# EAGLE design lopen (EAGLE 5.11)
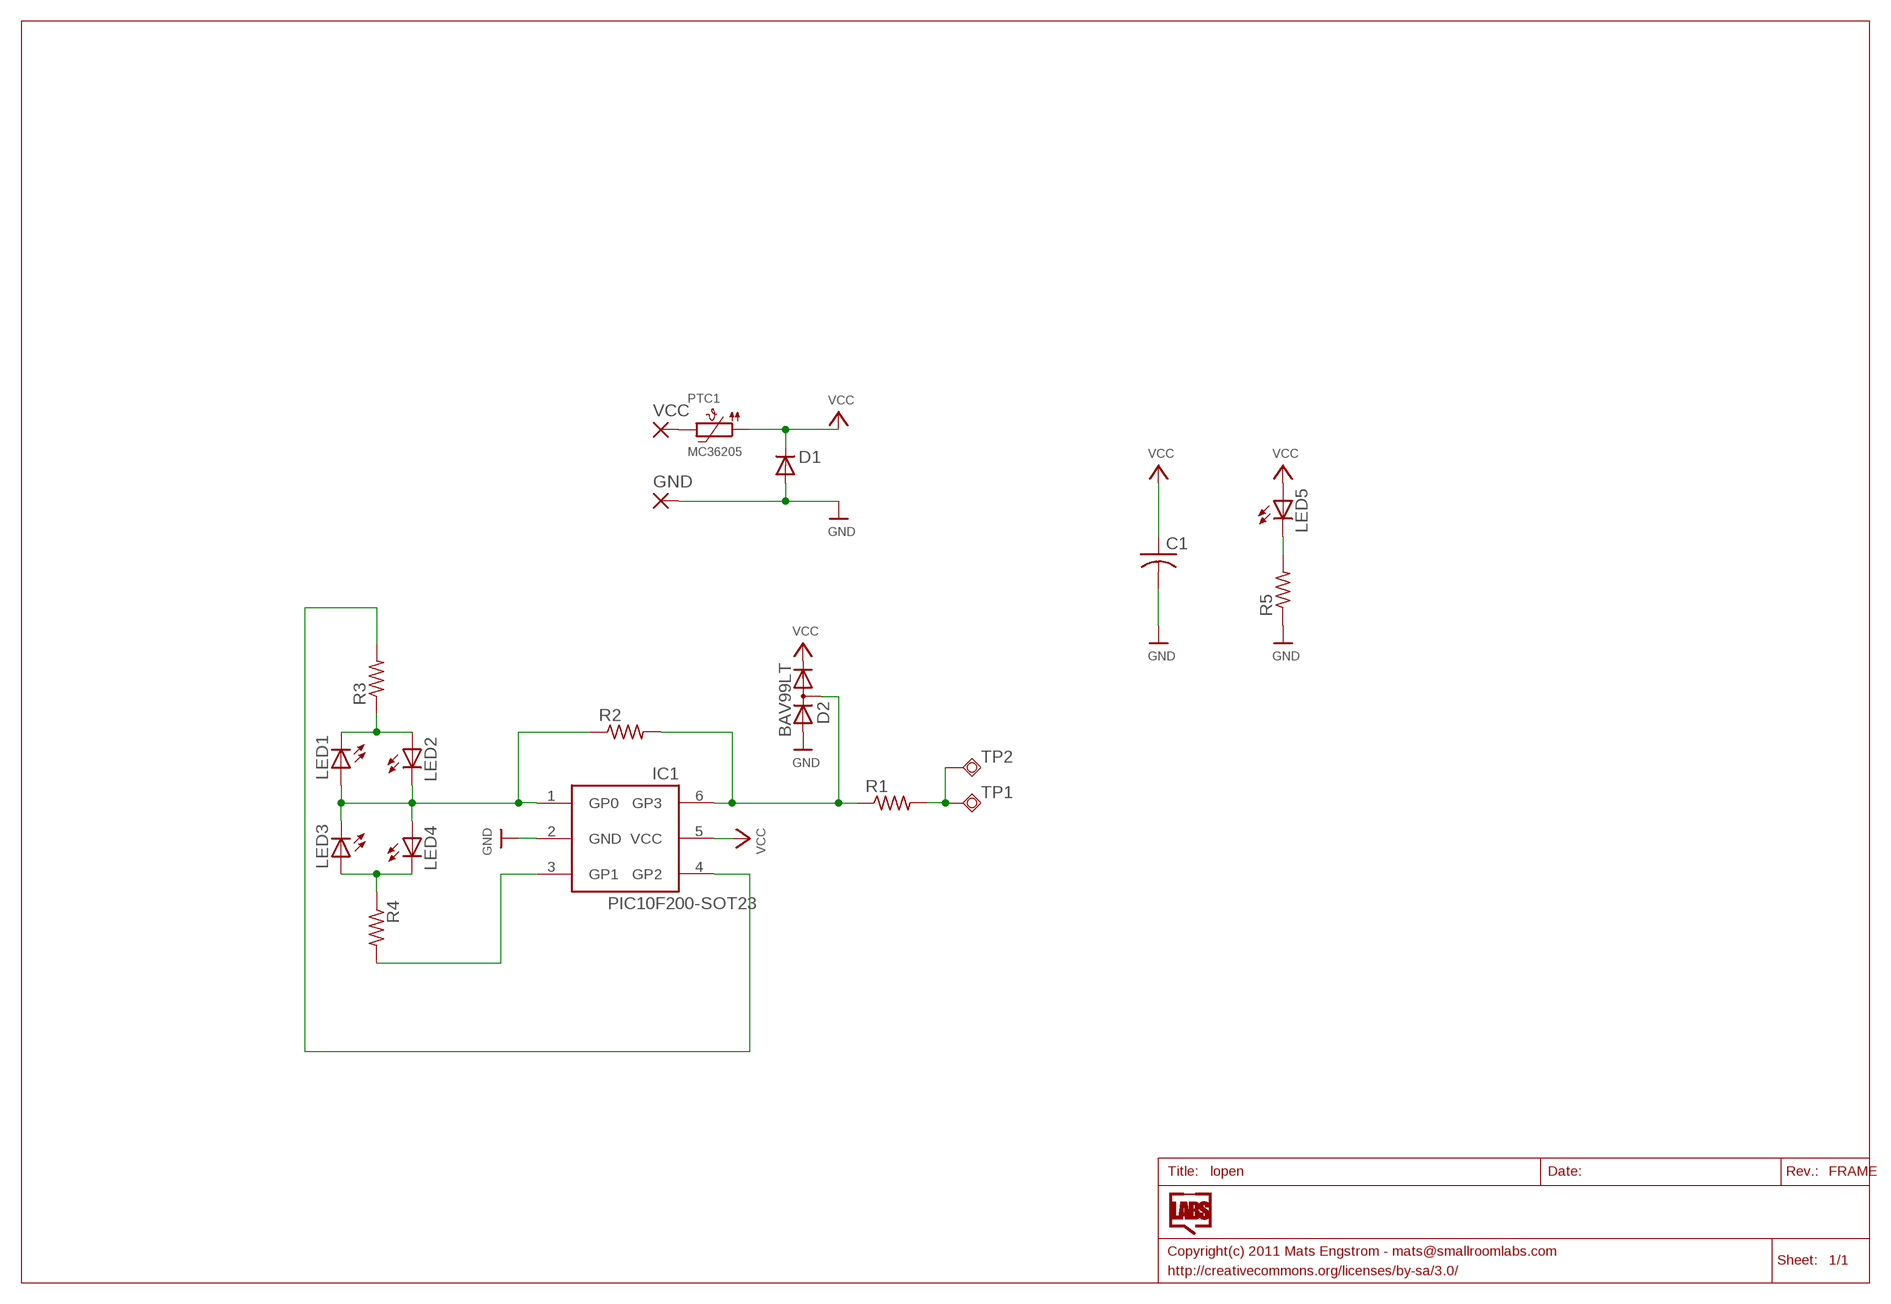
[diagram p0: schematic, sheet 1]

## Parts
C1  C-USC0805  [C0805]
D1  DIODESMA  [SMA-DIODE]
D2  BAV99LT  DIODE_2CACA-SOT23  [SOT23]
GND  1,6/0,8  [1,6/0,8]
IC1  PIC10F200-SOT23  [SOT23-6]
LED1  LEDCHIP-LED0805  [CHIP-LED0805]
LED2  LEDCHIP-LED0805  [CHIP-LED0805]
LED3  LEDCHIP-LED0805  [CHIP-LED0805]
LED4  LEDCHIP-LED0805  [CHIP-LED0805]
LED5  LEDCHIP-LED0805  [CHIP-LED0805]
PTC1  MC36205  PTC1206  [1206]
R1  R-US_R0805  [R0805]
R2  R-US_R0805  [R0805]
R3  R-US_R0805  [R0805]
R4  R-US_R0805  [R0805]
R5  R-US_R0805  [R0805]
TP1  TPSQTP18SQ  [TP18SQ]
TP2  TPSQTP18SQ  [TP18SQ]
VCC  1,6/0,8  [1,6/0,8]

## Nets
GND: C1.2 D1.A D2.1(A) GND.1(P) IC1.2(GND) R5.1
LED_CENTER: IC1.1(GP0) LED1.A LED2.C LED3.C LED4.A R2.1
LED_ONE: IC1.4(GP2) R3.2
LED_TWO: IC1.3(GP1) R4.2
N$1: LED5.C R5.2
N$2: PTC1.2 VCC.1(P)
N$5: LED1.C LED2.A R3.1
N$6: LED3.A LED4.C R4.1
N$9: R1.2 TP1.TP TP2.TP
SENSE: D2.3(AC) IC1.6(GP3) R1.1 R2.2
VCC: C1.1 D1.C D2.2(C) IC1.5(VCC) LED5.A PTC1.1

## Library data of the parts
C1 = adafruit:C-US: CAPACITOR, American symbol
D1 = SparkFun:DIODE: Diode These are standard reverse protection diodes and small signal diodes. SMA package can handle up to about 1A. SOD-323 can handle about 200mA. What the SOD-323 package when ordering, there are some mfgs out there that are 5-pin packages.
D2 = diode:DIODE_2CACA-: 2 Diodes - Cathode-Anode|Cathode-Anode
GND VCC = wirepad:1,6/0,8: THROUGH-HOLE PAD
IC1 = SmallRoomLabs:PIC10F200
LED1-LED5 = adafruit:LED: LED OSRAM: - CHIPLED LG R971, LG N971, LY N971, LG Q971, LY Q971, LO R971, LY R971 LH N974, LH R974 LS Q976, LO Q976, LY Q976 LO Q996 - Hyper CHIPLED LW Q18S LB Q993, LB Q99A, LB R99A - SideLED LS A670, LO A670, LY A670, LG A670, LP A670 LB A673, LV A673, LT A673, LW A673 LH A674 LY A675 LS A676, LA A676, LO A676, LY A676, LW A676 LS A679, LY A679, LG A679 - Hyper Micro SIDELED® LS Y876, LA Y876, LO Y876, LY Y876 LT Y87S - SmartLED LW L88C, LW L88S LB L89C, LB L89S, LG L890 LS L89K, LO L89K, LY L89K LS L896, LA L896, LO L896, LY L896 - TOPLED LS T670, LO T670, LY T670, LG T670, LP T670 LSG T670, LSP T670, LSY T670, LOP T670, LYG T670 LG T671, LOG T671, LSG T671 LB T673, LV T673, LT T673, LW T673 LH T674 LS T676, LA T676, LO T676, LY T676, LB T676, LH T676, LSB T676, LW T676 LB T67C, LV T67C, LT T67C, LS T67K, LO T67K, LY T67K, LW E67C LS E67B, LA E67B, LO E67B, LY E67B, LB E67C, LV E67C, LT E67C LW T67C LS T679, LY T679, LG T679 LS T770, LO T770, LY T770, LG T770, LP T770 LB T773, LV T773, LT T773, LW T773 LH T774 LS E675, LA E675, LY E675, LS T675 LS T776, LA T776, LO T776, LY T776, LB T776 LHGB T686 LT T68C, LB T68C - Hyper Mini TOPLED® LB M676 - Mini TOPLED Santana® LG M470 LS M47K, LO M47K, LY M47K Source: http://www.osram.convergy.de/
PTC1 = microbuilder:PTC: PTC (Resettable Fuse) 1206 Package 250mA PTC (16V Max, Time-to-Trip: 0.08s) - Digikey: F2110CT-ND 1210 Package 100mA PTC (30V Max, Time-to-Trip: 0.6s) - Digikey: MF-USMF010-2CT-ND 1812 Package 750mA PTC (24V Max, Time-to-Trip: 0.2s) - Digikey: MF-MSMF075/24-2CT-ND
R1-R5 = adafruit:R-US_: RESISTOR, American symbol
TP1 TP2 = testpad:TPSQ: Test pad

## Net classes
0 default: width 0.152 mm, clearance 0.152 mm

## Board
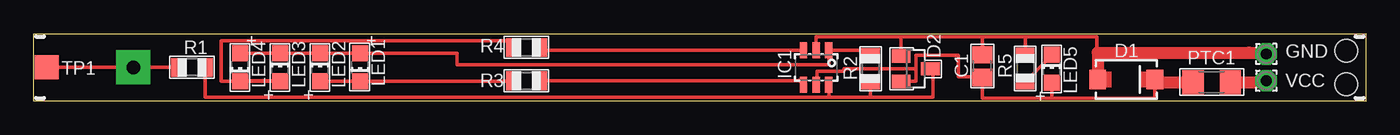
[diagram p1: board, top side]
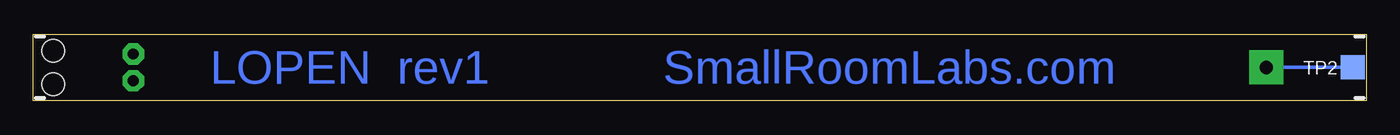
[diagram p2: board, bottom side, seen from below]

Size 100 x 5 mm. Coordinates in mm from the lower left corner, seen from the top.
Outline: 0,0 100,0 100,5 0,5 0,0
Copper layers (1*16): Top 0.035mm / dielectric 1.5mm / Bottom 0.035mm
Design rules "Fusion_eagle_rule_v1.1": minimum track width 6mil, minimum drill 12mil, track to track 6mil, track to pad 6mil, pad to pad 6mil, via to via 6mil, smd to smd 0mil, copper to edge 10mil, drill to drill 10mil, minimum pad ring 10mil, minimum via ring 6mil, stop-mask expansion 2mil, vias tented up to drill 100mil, thermal gap 10mil
Holes 1.7 mm at 98.5,3.75 98.5,1.25

### Footprints (pad centres in the part's own frame; a part is rotated, then mirrored left to right if it is on the bottom)
C0805 = smd 1.3 x 1.5: 1 -0.85,0; 2 0.85,0
SMA-DIODE = smd 1.27 x 1.47: A -2.15,0; C 2.15,0
SOT23 = smd 1 x 1.4: 1 -0.95,-1.1; 2 0.95,-1.1; 3 0,1.1
1,6/0,8 = drill 0.813 pad 1.6 octagon: 1 0,0
SOT23-6 = smd 0.55 x 1.2: 1 0.32,-1.3; 2 1.27,-1.3; 3 2.22,-1.3; 4 2.22,1.3; 5 1.27,1.3; 6 0.32,1.3
CHIP-LED0805 = smd 1.2 x 1.2: A 0,-1.05; C 0,1.05
1206 = smd 1.6 x 1.8: 1 -1.4,0; 2 1.4,0
R0805 = smd 1.1 x 1.4: 1 -1,0; 2 1,0
TP18SQ = smd 1.8 x 1.8: TP 0,0

### Placement (x,y rotation side)
C1  71.2,2.6 90 top
D1  82,1.6 0 top
D2  66.2,2.4 270 top
GND  92.5,3.5 0 top
IC1  60,2.5 180 top
LED1  24.5,2.5 180 top
LED2  21.5,2.5 0 top
LED3  18.5,2.5 0 top
LED4  15.5,2.5 180 top
LED5  76.4,2.4 0 top
PTC1  88.4,1.4 0 top
R1  11.9,2.5 180 top
R2  62.8,2.4 270 top
R3  37,1.5 0 top
R4  37,4 0 top
R5  74.42,2.43 270 top
TP1  1,2.5 0 top
TP2  1.02,2.51 0 bottom
VCC  92.5,1.5 0 top

### Tracks (layer width: path | path; a pad name or v marks a point on that pad's centre or on a via)
GND
  Top 0.254: IC1.2 58.73,4.8 65,4.8 | 65,4.8 71.2,4.8 | 71.2,4.8 C1.2 71.2,4.8 | D2.1 65.1,4.8 65,4.8 | 71.2,4.8 74.42,4.8 | 92.5,3.6 GND.1 | 74.42,4.8 R5.1 | 74.42,4.8 79.8,4.8 79.8,3.6 79.85,3.6
  Top 0.914: 92.5,3.6 91.2,3.6 79.85,3.6 D1.A
LED_CENTER
  Top 0.254: LED4.A LED3.C LED2.C LED1.A 31.8,3.55 31.8,2.7 59.68,2.7 IC1.1 62.5,3.8
  Top 0.3: 62.5,3.8 R2.1
LED_ONE
  Top 0.254: R3.2 57.48,1.5
  Top 0.3: 57.48,1.5 arc-90 IC1.4
LED_TWO
  Top 0.254: 38.14,3.8 IC1.3
  Top 0.3: R4.2 38.14,3.8
N$1
  Top 0.254: LED5.C 76.4,3.26 76.26,3.26 R5.2
N$2
  Top 0.254: 92.5,1.4 VCC.1
  Top 0.914: PTC1.2 92.5,1.4
N$5
  Top 0.254: LED2.A LED1.C 36.06,1.45
  Top 0.3: 36.06,1.45 R3.1
N$6
  Top 0.254: LED3.A 14.1,1.45 14.1,4.5 36.06,4.5 R4.1
  Top 0.3: LED3.A LED4.C
N$9  (via drill 1 pad 2.54)
  Top 0.254: R1.2 v7.5,2.5 TP1.TP
  Bottom 0.254: TP2.TP 2.87,2.5 v7.5,2.5
SENSE
  Top 0.254: 59.74,0.25 12.89,0.25 R1.1 | 59.74,0.25 60,0.25 62.8,0.25 | 62.8,0.25 R2.2 | IC1.6 59.68,0.25 59.74,0.25 | D2.3 67.5,2.4 67.5,0.25 62.8,0.25
VCC
  Top 0.254: 84.35,1.4 D1.C 84.15,0.2 83.8,0.2 76.4,0.2 | 76.4,0.2 71.2,0.2 C1.1 71.2,1.8 69.4,1.8 69.4,3.4 68.8,3.4 66.2,3.4 66.2,2.4 | 76.4,0.2 LED5.A | 66.2,2.4 60.8,2.4 60.8,2.2 58.8,2.2 58.8,1.2 IC1.5 | 66.2,2.4 66.2,1.45 D2.2
  Top 0.914: 84.35,1.4 PTC1.1
(copper drawn outside any net)
  shapes: Top area x2

### Text on the board
Bottom: SmallRoomLabs.com | LOPEN rev1
tNames: R1 | LED1 | LED4 | LED3 | LED2 | R4 | IC1 | D2 | D1 | PTC1 | GND | TP1 | R2 | C1 | R5 | R3 | LED5 | VCC